# Altium project Pill_STM32F405.PrjPcb
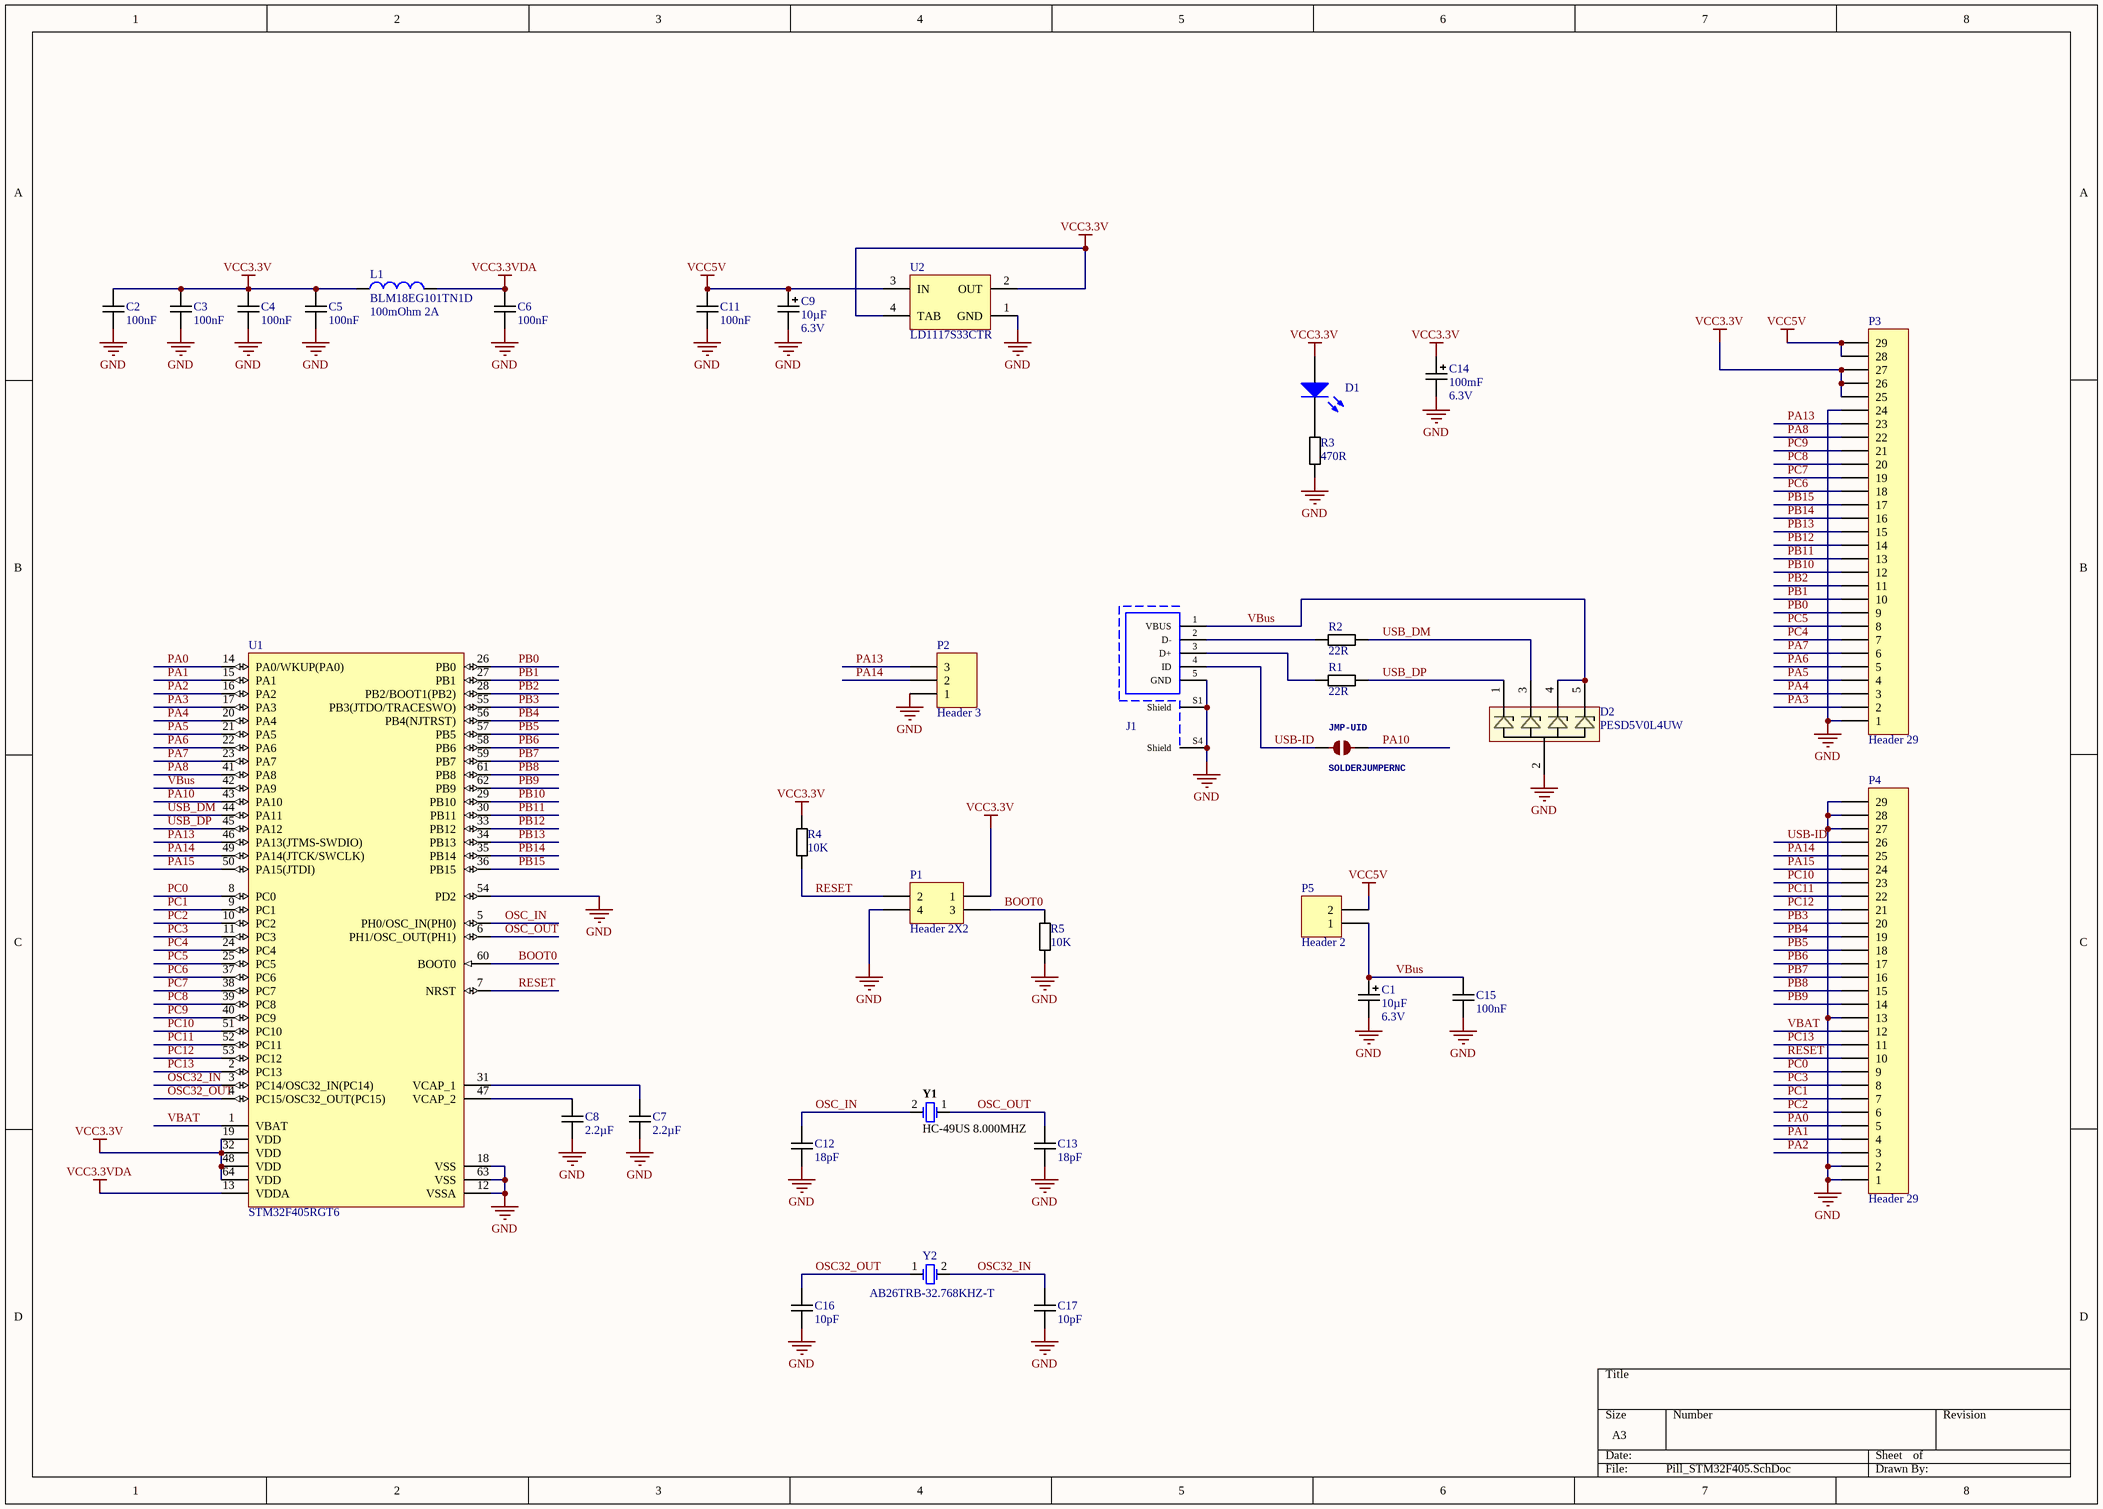
[diagram p0: Pill_STM32F405.SchDoc]
1 sheet, 35 parts. Net scope: global (net labels, ports and power ports of the same name join across sheets).
Board file: Pill_STM32F405.PcbDoc

## Sheet Pill_STM32F405.SchDoc
size A3

### Parts
C1  10µF  Voltage - Rated: 6.3V  [Body_A_M__CAPMP3216X18N]
C2  100nF  [0603-CAP]
C3  100nF  [0603-CAP]
C4  100nF  [0603-CAP]
C5  100nF  [0603-CAP]
C6  100nF  [0603-CAP]
C7  2.2µF  [0603-CAP]
C8  2.2µF  [0603-CAP]
C9  10µF  Voltage - Rated: 6.3V  [Body_A_M__CAPMP3216X18N]
C11  100nF  [0603-CAP]
C12  18pF  [0603-CAP]
C13  18pF  [0603-CAP]
C14  100mF  Voltage - Rated: 6.3V  [Body_C_L__CAPMP6032X28M]
C15  100nF  [0603-CAP]
C16  10pF  [0603-CAP]
C17  10pF  [0603-CAP]
D1  LTST-C170KRKT  [LED 0805 RED SMD]  (value not drawn)
D2  PESD5V0L4UW  [PESD5V0L4UW]
J1  Micro USB 2.0 Type AB Receptacle  [USB-MICROB-SMD]  (value not drawn)
JMP-UID  SOLDERJUMPERNC  [SJ_2S]  (no BOM)
L1  BLM18EG101TN1D  Features: 100mOhm 2A  [BLM18]
P1  Header 2X2  [HDR2X2]
P2  Header 3  [HDR1X3]
P3  Header 29  [HDR1X29]
P4  Header 29  [HDR1X29]
P5  Header 2  [HDR1X2]
R1  22R  [0603-RES]
R2  22R  [0603-RES]
R3  470R  [0603-RES]
R4  10K  [0603-RES]
R5  10K  [0603-RES]
U1  STM32F405RGT6  [LQFP64]
U2  LD1117S33CTR  [MP04A_N]
Y1  HC-49US 8.000MHZ  [JPY-HC-49US]
Y2  AB26TRB-32.768KHZ-T  [AB26TRB32768KHZT]

### Nets
GND: C1.2 C2.1 C3.1 C4.1 C5.1 C6.1 C7.1 C8.1 C9.2 C11.1 C12.1 C13.1 C14.2 C15.1 C16.1 C17.1 D2.2 J1.5(GND) J1.S1(Shield) J1.S4(Shield) P1.4 P2.1 P3.1 P3.24 P4.1 P4.2 P4.13 P4.27 P4.28 P4.29 R3.1 R5.1 U1.12(VSSA) U1.18(VSS) U1.54(PD2) U1.63(VSS) U2.1(GND)
VCC3.3V: C2.2 C3.2 C4.2 C5.2 C14.1 D1.1(A) L1.1 P1.1 P3.25 P3.26 P3.27 R4.1 U1.19(VDD) U1.32(VDD) U1.48(VDD) U1.64(VDD) U2.2(OUT) U2.4(TAB)
VCC3.3VDA: C6.2 L1.2 U1.13(VDDA)
VCC5V: C9.1 C11.2 P3.28 P3.29 P5.2 U2.3(IN)
BOOT0: P1.3 R5.2 U1.60(BOOT0)
OSC32_IN: C17.2 U1.3(PC14/OSC32_IN(PC14)) Y2.2
OSC32_OUT: C16.2 U1.4(PC15/OSC32_OUT(PC15)) Y2.1
OSC_IN: C12.2 U1.5(PH0/OSC_IN(PH0)) Y1.2
OSC_OUT: C13.2 U1.6(PH1/OSC_OUT(PH1)) Y1.1
PA0: P4.5 U1.14(PA0/WKUP(PA0))
PA1: P4.4 U1.15(PA1)
PA2: P4.3 U1.16(PA2)
PA3: P3.2 U1.17(PA3)
PA4: P3.3 U1.20(PA4)
PA5: P3.4 U1.21(PA5)
PA6: P3.5 U1.22(PA6)
PA7: P3.6 U1.23(PA7)
PA8: P3.22 U1.41(PA8)
PA10: JMP-UID.2 U1.43(PA10)
PA13: P2.3 P3.23 U1.46(PA13(JTMS-SWDIO))
PA14: P2.2 P4.25 U1.49(PA14(JTCK/SWCLK))
PA15: P4.24 U1.50(PA15(JTDI))
PB0: P3.9 U1.26(PB0)
PB1: P3.10 U1.27(PB1)
PB2: P3.11 U1.28(PB2/BOOT1(PB2))
PB3: P4.20 U1.55(PB3(JTDO/TRACESWO))
PB4: P4.19 U1.56(PB4(NJTRST))
PB5: P4.18 U1.57(PB5)
PB6: P4.17 U1.58(PB6)
PB7: P4.16 U1.59(PB7)
PB8: P4.15 U1.61(PB8)
PB9: P4.14 U1.62(PB9)
PB10: P3.12 U1.29(PB10)
PB11: P3.13 U1.30(PB11)
PB12: P3.14 U1.33(PB12)
PB13: P3.15 U1.34(PB13)
PB14: P3.16 U1.35(PB14)
PB15: P3.17 U1.36(PB15)
PC0: P4.9 U1.8(PC0)
PC1: P4.7 U1.9(PC1)
PC2: P4.6 U1.10(PC2)
PC3: P4.8 U1.11(PC3)
PC4: P3.7 U1.24(PC4)
PC5: P3.8 U1.25(PC5)
PC6: P3.18 U1.37(PC6)
PC7: P3.19 U1.38(PC7)
PC8: P3.20 U1.39(PC8)
PC9: P3.21 U1.40(PC9)
PC10: P4.23 U1.51(PC10)
PC11: P4.22 U1.52(PC11)
PC12: P4.21 U1.53(PC12)
PC13: P4.11 U1.2(PC13)
RESET: P1.2 P4.10 R4.2 U1.7(NRST)
USB-ID: J1.4(ID) JMP-UID.1 P4.26
USB_DM: D2.3 R2.1 U1.44(PA11)
USB_DP: D2.1 R1.1 U1.45(PA12)
VBAT: P4.12 U1.1(VBAT)
VBus: C1.1 C15.2 D2.4 D2.5 J1.1(VBUS) P5.1 U1.42(PA9)
NetC7_2: C7.2 U1.31(VCAP_1)
NetC8_2: C8.2 U1.47(VCAP_2)
NetD1_2: D1.2(K) R3.2
NetJ1_2: J1.2(D-) R2.2
NetJ1_3: J1.3(D+) R1.2

### Library data of the parts
C1 C9 = Capacitor Polarized: 10µF Molded Tantalum Capacitors 6.3V 1206 (3216 Metric) 4Ohm @ 100kHz; Manufacturer: AVX Corporation; Manufacturer PN: TAJA106M006SNJ; Tolerance: 5%; Value: 10µF; URL Digi-Key: https://www.digikey.com/en/products/detail/avx-corporation/TAJA106M006SNJ/11201726; Temperature Coefficient: *; Operating Temperature: *; Features: *
C2-C6 C11 C15 = Capacitor_0603_100nF: Capacitor 0603 100nF 50V; Manufacturer: TDK Corporation; Manufacturer PN: CGA3E2X7R1H104K080AA; Tolerance: ±10%; Temperature Coefficient: X7R; Value: 100nF; Voltage - Rated: 50V; URL Digi-Key: https://www.digikey.com/product-detail/en/tdk-corporation/CGA3E2X7R1H104K080AA/445-5666-1-ND/2443706; Operating Temperature: -55°C ~ 125°C; Features: Automotive
C7 C8 = Capacitor_0603_2.2µF: Capacitor 0603 2.2µF 6.3V; Manufacturer: TDK Corporation; Manufacturer PN: CGA3E1X7R0J225K080AC; Tolerance: ±10%; Temperature Coefficient: X7R; Value: 2.2µF; Voltage - Rated: 6.3V; URL Digi-Key: https://www.digikey.com/en/products/detail/tdk-corporation/CGA3E1X7R0J225K080AC/2672826?s=N4IgTCBcDaIMIHECCBmAogRgBoHYBKGaYYArANIAMAHBUnCALoC%2BQA; Operating Temperature: -55°C ~ 125°C; Features: Automotive
C12 C13 = Capacitor_0603_18pF: Capacitor 0603 18pF 100V; Manufacturer: TDK Corporation; Manufacturer PN: CGA3E2C0G2A180J080AA; Tolerance: ±5%; Temperature Coefficient: C0G, NP0; Value: 18pF; Voltage - Rated: 100V; URL Digi-Key: https://www.digikey.com/product-detail/en/tdk-corporation/CGA3E2C0G2A180J080AA/445-12321-1-ND/3953987; Operating Temperature: -55°C ~ 125°C; Features: Automotive
C14 = Capacitor Polarized: 100µF Molded Tantalum Capacitors 6.3V 2312 (6032 Metric) 900mOhm; Manufacturer: AVX Corporation; Manufacturer PN: TAJC107K006SNJ; Tolerance: 5%; Value: 100mF; URL Digi-Key: https://www.digikey.com/en/products/detail/avx-corporation/TAJC107K006SNJ/11266696; Temperature Coefficient: *; Operating Temperature: *; Features: *
C16 C17 = Capacitor_0603_10pF: Capacitor 0603 10pF 100V; Manufacturer: TDK Corporation; Manufacturer PN: CGA3E2C0G2A100D080AA; Tolerance: ±0.5%; Temperature Coefficient: C0G, NP0; Value: 10pF; Voltage - Rated: 100V; URL Digi-Key: https://www.digikey.com/product-detail/en/tdk-corporation/CGA3E2C0G2A100D080AA/445-12318-1-ND/3953984; Operating Temperature: -55°C ~ 125°C; Features: Automotive
D1 = LED 0805 RED SMD: LED RED  0805 SMD; Manufacturer: Lite-On Inc.; URL Digi-Key: https://www.digikey.com/product-detail/en/lite-on-inc/LTST-C170KRKT/160-1415-1-ND/386778; Manufacturer PN: LTST-C170KRKT; Datasheet: *; Value: *; Tolerance: *; Voltage - Rated: *; Temperature Coefficient: *; Operating Temperature: *; Capacitance: *; Power (Watts): *
D2 = PESD5V0L4UW: TVS DIODE 5V 13V 5TSSOP; Manufacturer PN: PESD5V0L4UG,115; Manufacturer: Nexperia USA Inc.; URL Digi-Key: https://www.digikey.com/product-detail/en/nexperia-usa-inc/PESD5V0L4UG115/1727-3835-6-ND/1530880; Datasheet: *; Value: *; Tolerance: *; Voltage - Rated: *; Temperature Coefficient: *; Operating Temperature: *; Features: *; Capacitance: *; Power (Watts): *
J1 = KLS1-233-1-0-0-R: USB - micro B USB 2.0 Receptacle Connector 5 Position Surface Mount, Right Angle; Through Hole; Manufacturer PN: L-KLS1-233-0-0-0-R; Manufacturer: KLS electronic co ltd; Rated Current: 1.8A; Pin Number: 5; Working Voltage: 100VAC; ComponentLink1Description: Manufacturer; ComponentLink1URL: http://www.we-online.de; ComponentLink2Description: Datasheet; ComponentLink2URL: https://katalog.we-online.com/em/datasheet/629105150921.pdf; Type: Horizontal; Operating Temperature: -30°C ~ 80°C; Mounting Technology: SMT
JMP-UID = SOLDERJUMPERNC: Solder JumperStandard SMD solder jumper. Used to automate production. Two varients : Normally Open and Normally Closed are the same, but have different paste layers. NC will have a large amount of paste and should jumper during reflow.; GateName_1: 1; SymbolName_1: SJ; DeviceName: NC; LibraryName: stm32f4stamp; DeviceSetName: SOLDERJUMPER
L1 = BLM18EG101TN1D: 100 Ohms @ 100MHz 1  Ferrite Bead 0603 (1608 Metric) 2A 45mOhm; Manufacturer: Murata Electronics North America; URL Digi-Key: https://www.digikey.com/product-detail/en/murata-electronics-north-america/BLM18EG101TN1D/490-5978-1-ND/3845178; Manufacturer PN: BLM18EG101TN1D; Datasheet: *; Value: *; Tolerance: *; Voltage - Rated: *; Temperature Coefficient: *; Operating Temperature: -55°C ~ 125°C; Capacitance: *; Power (Watts): *
P1 = Header 2X2: CONN HEADER VERT 4POS 2.54MM; Manufacturer PN: PRPC002DAAN-RC; Manufacturer: Sullins Connector Solutions; URL Digi-Key: https://www.digikey.com/product-detail/en/sullins-connector-solutions/PRPC002DAAN-RC/S2011EC-02-ND/2775292; Datasheet: *; Value: *; Tolerance: *; Voltage - Rated: *; Temperature Coefficient: *; Operating Temperature: *; Features: *; Capacitance: *; Power (Watts): *
P2 = Header 3: Header, 3-Pin 2.54mm; Manufacturer PN: TSW-103-07-F-S; Manufacturer: Samtec Inc.; URL Digi-Key: https://www.digikey.com/product-detail/en/samtec-inc/TSW-103-07-F-S/SAM8995-ND/2685877; Datasheet: *; Value: *; Tolerance: *; Voltage - Rated: *; Temperature Coefficient: *; Operating Temperature: *; Features: *; Capacitance: *; Power (Watts): *
P3 P4 = Header 29: CONN HEADER VERT 29POS 2.54MM; Manufacturer PN: PRPC029SAAN-RC; Manufacturer: Sullins Connector Solutions; URL Digi-Key: https://www.digikey.com/en/products/detail/sullins-connector-solutions/PRPC029SAAN-RC/2775225; Datasheet: *; Value: *; Tolerance: *; Voltage - Rated: *; Temperature Coefficient: *; Operating Temperature: *; Features: *; Capacitance: *; Power (Watts): *
P5 = Header 2: Header, 2-Pin 2.54mm; Manufacturer PN: TSW-102-07-F-S; Manufacturer: Samtec Inc.; URL Digi-Key: https://www.digikey.com/product-detail/en/samtec-inc/TSW-102-07-F-S/SAM10844-ND/2685866; Datasheet: *; Value: *; Tolerance: *; Voltage - Rated: *; Temperature Coefficient: *; Operating Temperature: *; Features: *; Capacitance: *; Power (Watts): *
R1 R2 = R_0603_22R_5%: Resistors 0603 5%; Manufacturer: Panasonic Electronic Components; Manufacturer PN: ERJ-3GEYJ220V; Temperature Coefficient: ±200ppm/°C; Power (Watts): 0.1W, 1/10W; Value: 22R; Tolerance: 5%; URL Digi-Key: https://www.digikey.com/product-detail/en/panasonic-electronic-components/ERJ-3GEYJ220V/P22GCT-ND/134662; Features: Automotive AEC-Q200
R3 = R_0603_470R_5%: Resistors 0603 5%; Manufacturer: Panasonic Electronic Components; Manufacturer PN: ERJ-3GEYJ471V; Temperature Coefficient: ±200ppm/°C; Power (Watts): 0.1W, 1/10W; Value: 470R; Tolerance: 5%; URL Digi-Key: https://www.digikey.com/product-detail/en/panasonic-electronic-components/ERJ-3GEYJ471V/P470GCT-ND/134802; Features: Automotive AEC-Q200
R4 R5 = R_0603_10K_5%: Resistors 0603 5%; Manufacturer: Panasonic Electronic Components; Manufacturer PN: ERJ-3GEYJ103V; Temperature Coefficient: ±200ppm/°C; Power (Watts): 0.1W, 1/10W; Value: 10K; Tolerance: 5%; URL Digi-Key: https://www.digikey.com/product-detail/en/panasonic-electronic-components/ERJ-3GEYJ103V/P10KGCT-ND/134717; Features: Automotive AEC-Q200
U1 = STM32F405RGT6: ARM Cortex-M4 32-bit MCU+FPU, 1024 KB Flash, 192 KB Internal RAM, 51 I/Os, 64-Pin LQFP, -40 to 85 degC, Tape and Reel; Manufacturer: STMicroelectronics; Internal RAM Size (kB): 192; FLASH Size (Prog) (kB): 1024; Supply Voltage(Vcc) min (V): 1.8; D/A Converter: 2; Operating Frequency(F) (Processor speed) (MHz): 168; I/Os (High Current): 51; DatasheetVersion: Rev. 6; Package Description: LQFP64; ComponentLink2Description: Datasheet; ComponentLink1Description: Manufacturer URL; Packing: Tape and Reel; Mounting Technology: Surface Mount; Package Reference: 64-Pin Low-profile Quad Flat Package, Body 10 x 10 mm, Pitch 0.5 mm; ComponentLink2URL: http://www.st.com/st-web-ui/static/active/en/resource/technical/document/datasheet/DM00037051.pdf; ComponentLink1URL: http://www.st.com/; Core: ARM Cortex-M4; URL Digi-Key: https://www.digikey.com/product-detail/en/stmicroelectronics/STM32F405RGT6/497-11767-ND/2754208; Manufacturer PN: STM32F405RGT6
U2 = CMP-0062-01639-2: IC REG LINEAR 3.3V 800MA SOT223; Manufacturer: STMicroelectronics; ComponentLink2URL: http://www.national.com/pf/LM/LM1117.html; ComponentLink2Description: LM1117 Web Page; ComponentLink3Description: MP04A Package Page; ComponentLink1Description: LM1117 Datasheet; ComponentLink1URL: http://www.national.com/ds/LM/LM1117.pdf; ComponentLink3URL: http://www.national.com/packaging/folders/mp04a.html; Manufacturer PN: LD1117S33CTR; URL Digi-Key: https://www.digikey.com/product-detail/en/stmicroelectronics/LD1117S33CTR/497-1241-1-ND/586241
Y1 = CMP-2100-03645-1_1: Crystal, 8 MHz,   -55°C ~ 125°C; Manufacturer: ECS Inc.; Manufacturer PN: ECS-080-20-4X-DU; Datasheet URL: https://statics3.seeedstudio.com/images/opl/datasheet/306010014.pdf; Package Description: 2-Pin Throug Hole Device, Body 11.05 x 4.65 mm, Pitch 4.9 mm; Datasheet Version: 42125.0; Package Reference: HC-49US; URL Digi-Key: https://www.digikey.com/products/en/crystals-oscillators-resonators/crystals/171?k=&pkeyword=&pv252=25&FV=1140050%2Cffe000ab%2Cmu8MHz%7C2150&quantity=0&ColumnSort=0&page=1&stock=1&pageSize=25
Y2 = AB26TRB-32.768KHZ-T: 32.768kHz ±20ppm Crystal 12.5pF 50 kOhms Cylindrical Can, Radial; Manufacturer: ABRACON; URL Digi-Key: https://www.digikey.com/en/products/detail/abracon-llc/AB26TRB-32-768KHZ-T/675228?s=N4IgTCBcDaIIICEwDYAqAlBBaAzGAdAOzIAcA0gBIBaWqABCALoC%2BQA; Manufacturer PN: AB26TRB-32.768KHZ-T; Datasheet: *; Value: *; Tolerance: ±20ppm; Voltage - Rated: *; Temperature Coefficient: *; Operating Temperature: -40°C ~ 85°C; Features: *; Capacitance: 12.5pF; Power (Watts): *